# Altium schematic sheet ui_codec.SchDoc: mcHF Pro Transceiver UI board
size A3; Author: Krassi Atanassov; CompanyName: MØNKA; Engineer: For radio amateurs experimentation, non-commercial use only. Thank you!; Revision: 0.8.5; SheetTotal: 13
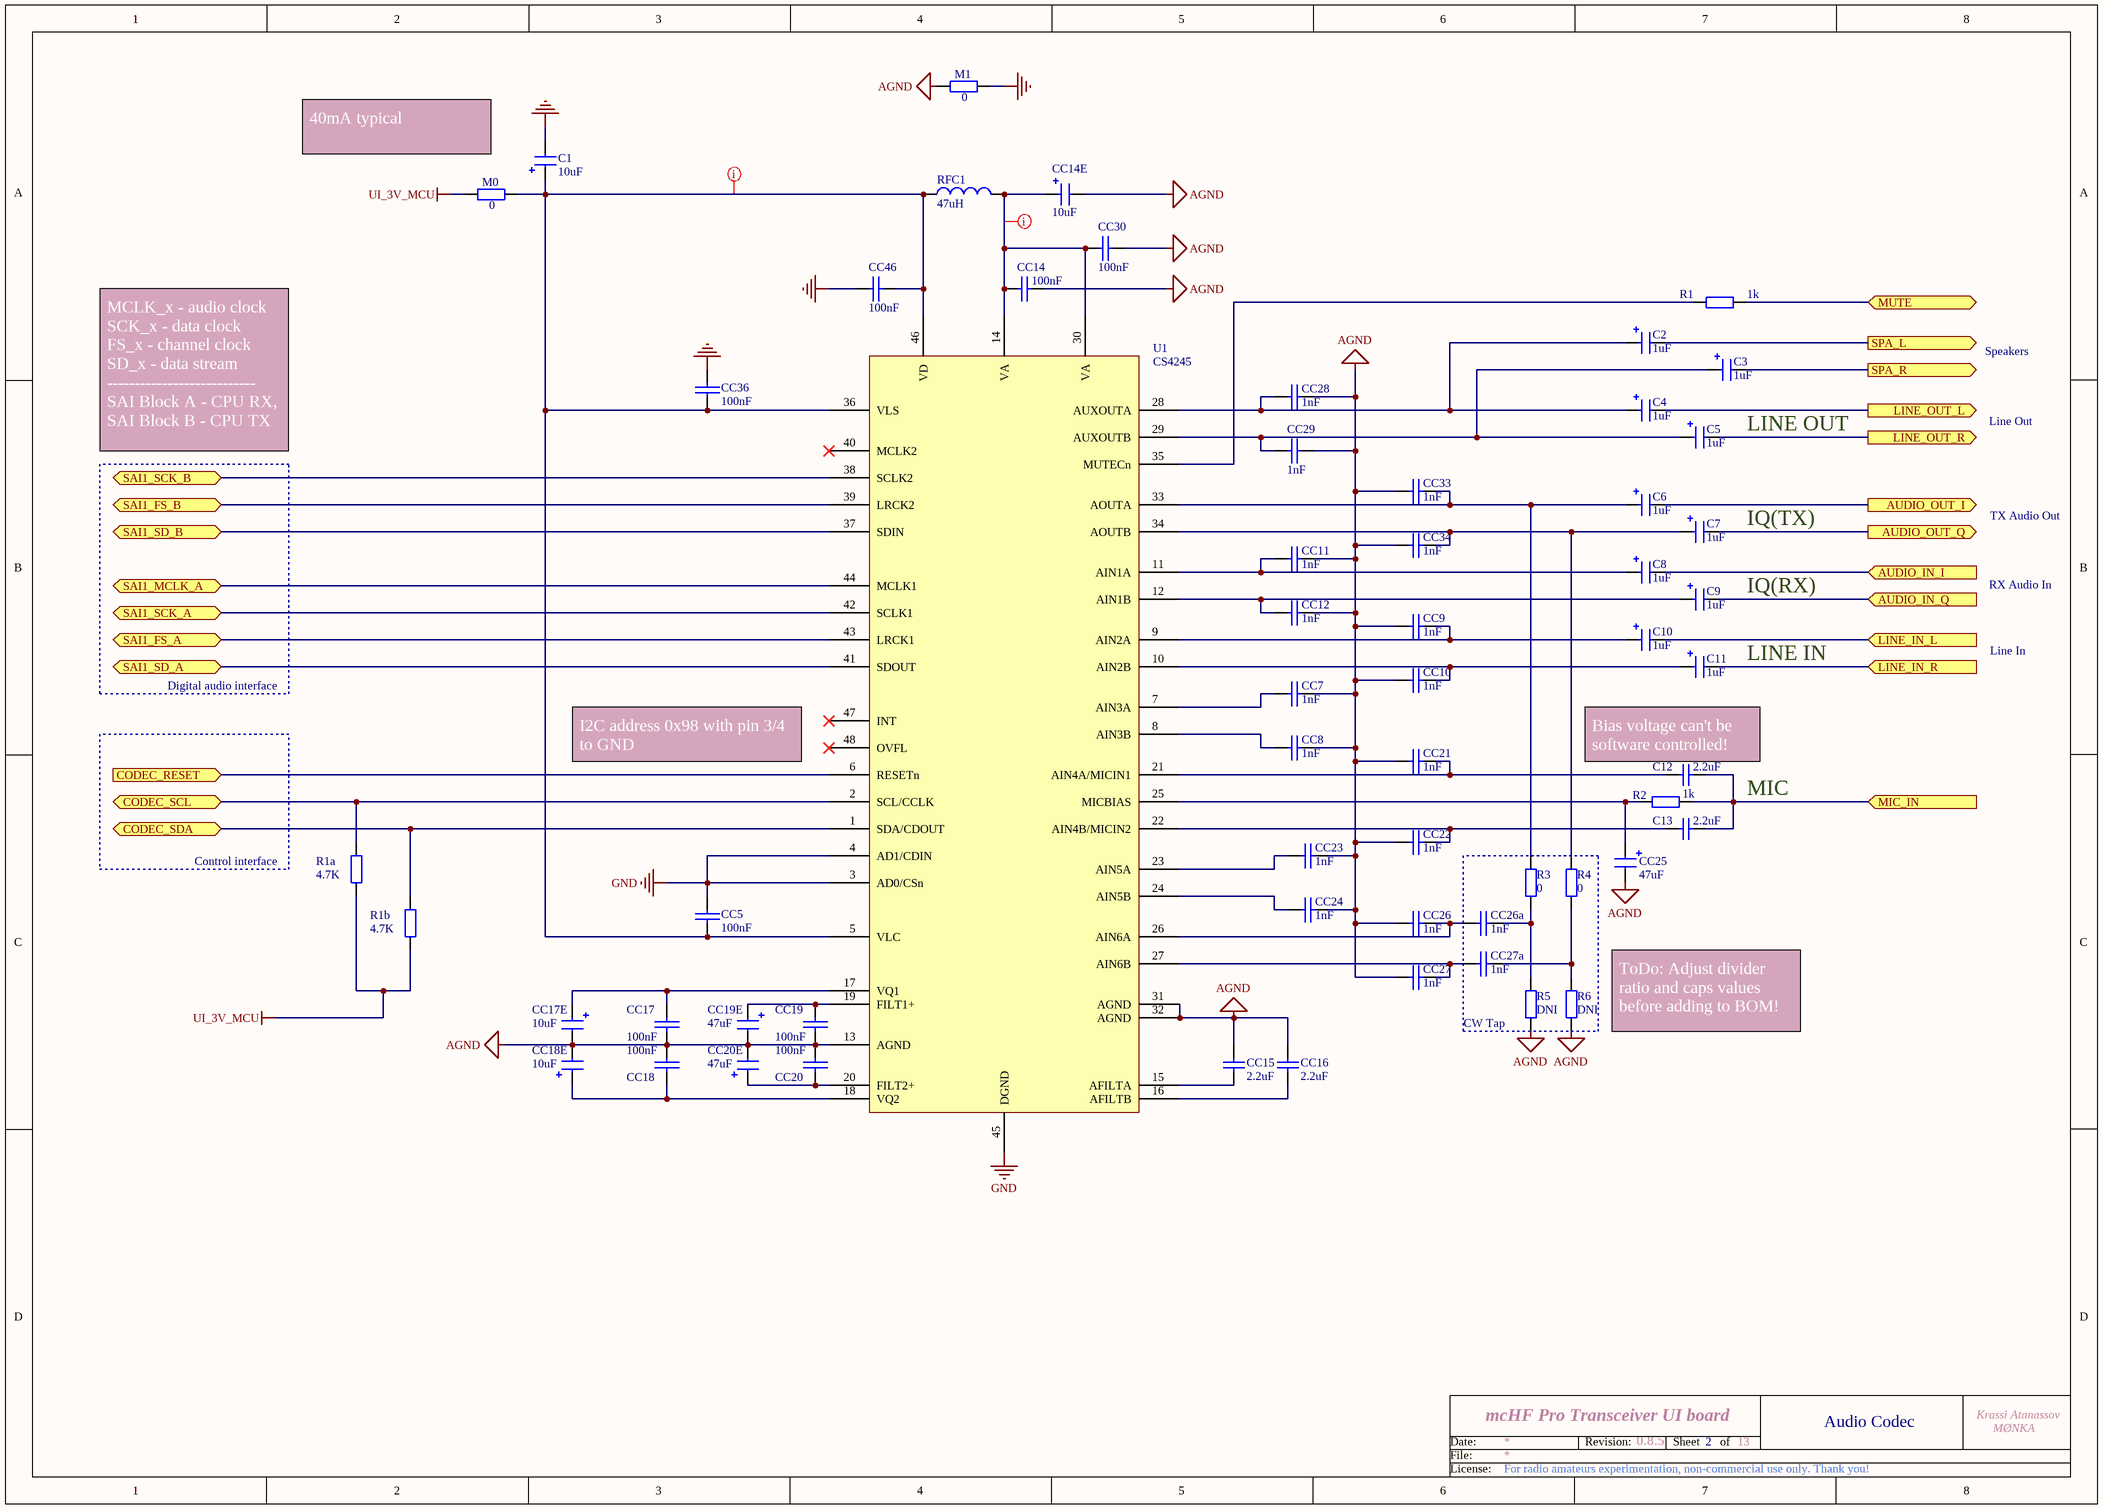
[diagram p0: ui_codec.SchDoc]

## Parts
C1  10uF  [1206_Elec_Cap]
C2  1uF  [1206_Elec_Cap]
C3  1uF  [1206_Elec_Cap]
C4  1uF  [1206_Elec_Cap]
C5  1uF  [1206_Elec_Cap]
C6  1uF  [1206_Elec_Cap]
C7  1uF  [1206_Elec_Cap]
C8  1uF  [1206_Elec_Cap]
C9  1uF  [1206_Elec_Cap]
C10  1uF  [1206_Elec_Cap]
C11  1uF  [1206_Elec_Cap]
C12  2.2uF  [0805]
C13  2.2uF  [0805]
CC5  100nF  [0805]
CC7  1nF  [0805]
CC8  1nF  [0805]
CC9  1nF  [0805]
CC10  1nF  [0805]
CC11  1nF  [0805]
CC12  1nF  [0805]
CC14  100nF  [0805]
CC14E  10uF  [1206_Elec_Cap]
CC15  2.2uF  [0805]
CC16  2.2uF  [0805]
CC17  100nF  [0805]
CC17E  10uF  [1206_Elec_Cap]
CC18  100nF  [0805]
CC18E  10uF  [1206_Elec_Cap]
CC19  100nF  [0805]
CC19E  47uF  [1206_Elec_Cap]
CC20  100nF  [0805]
CC20E  47uF  [1206_Elec_Cap]
CC21  1nF  [0805]
CC22  1nF  [0805]
CC23  1nF  [0805]
CC24  1nF  [0805]
CC25  47uF  [1206_Elec_Cap]
CC26  1nF  [0805]
CC26a  1nF  [0805]
CC27  1nF  [0805]
CC27a  1nF  [0805]
CC28  1nF  [0805]
CC29  1nF  [0805]
CC30  100nF  [0805]
CC33  1nF  [0805]
CC34  1nF  [0805]
CC36  100nF  [0805]
CC46  100nF  [0805]
M0  0  [0805]
M1  0  [0805]
R1  1k  [0805]
R1a  4.7K  [0805]
R1b  4.7K  [0805]
R2  1k  [0805]
R3  0  [0805]
R4  0  [0805]
R5  DNI  [0805]  (no BOM)
R6  DNI  [0805]  (no BOM)
RFC1  47uH  [0805]
U1  CS4245  [QUAD48]

## Blocks framed on the sheet
CW Tap: CC26a CC27a R3-R6

## Ports
AUDIO_IN_I (in), AUDIO_IN_Q (in), AUDIO_OUT_I (out), AUDIO_OUT_Q (out), CODEC_RESET (in), CODEC_SCL (bidir), CODEC_SDA (bidir), LINE_IN_L (in), LINE_IN_R (in), LINE_OUT_L (out), LINE_OUT_R (out), MIC_IN (in), MUTE (bidir), SAI1_FS_A (bidir), SAI1_FS_B (bidir), SAI1_MCLK_A (bidir), SAI1_SCK_A (bidir), SAI1_SCK_B (bidir), SAI1_SD_A (bidir), SAI1_SD_B (bidir), SPA_L (out), SPA_R (out)

## Nets
AGND: CC7.1 CC8.1 CC9.2 CC10.2 CC11.1 CC12.1 CC14.1 CC14E.2 CC15.1 CC16.1 CC17.1 CC17E.2 CC18.2 CC18E.2 CC19.1 CC19E.2 CC20.2 CC20E.2 CC21.2 CC22.2 CC23.1 CC24.1 CC25.2 CC26.2 CC27.2 CC28.1 CC29.1 CC30.1 CC33.2 CC34.2 M1.2 R5.2 R6.2 U1.13(AGND) U1.31(AGND) U1.32(AGND)
GND: C1.2 CC5.2 CC36.2 CC46.2 M1.1 U1.3(AD0/CSn) U1.4(AD1/CDIN) U1.45(DGND)
UI_3V_MCU: M0.2 R1a.2 R1b.2
AUDIO_IN_I: C8.2 ; port AUDIO_IN_I
AUDIO_IN_Q: C9.2 ; port AUDIO_IN_Q
AUDIO_OUT_I: C6.2 ; port AUDIO_OUT_I
AUDIO_OUT_Q: C7.2 ; port AUDIO_OUT_Q
CODEC_RESET: U1.6(RESETn) ; port CODEC_RESET
CODEC_SCL: R1a.1 U1.2(SCL/CCLK) ; port CODEC_SCL
CODEC_SDA: R1b.1 U1.1(SDA/CDOUT) ; port CODEC_SDA
LINE_IN_L: C10.2 ; port LINE_IN_L
LINE_IN_R: C11.2 ; port LINE_IN_R
LINE_OUT_L: C4.2 ; port LINE_OUT_L
LINE_OUT_R: C5.2 ; port LINE_OUT_R
MIC_IN: C12.2 C13.2 R2.1 ; port MIC_IN
MUTE: R1.1 ; port MUTE
SAI1_FS_A: U1.43(LRCK1) ; port SAI1_FS_A
SAI1_FS_B: U1.39(LRCK2) ; port SAI1_FS_B
SAI1_MCLK_A: U1.44(MCLK1) ; port SAI1_MCLK_A
SAI1_SCK_A: U1.42(SCLK1) ; port SAI1_SCK_A
SAI1_SCK_B: U1.38(SCLK2) ; port SAI1_SCK_B
SAI1_SD_A: U1.41(SDOUT) ; port SAI1_SD_A
SAI1_SD_B: U1.37(SDIN) ; port SAI1_SD_B
SPA_L: C2.2 ; port SPA_L
SPA_R: C3.2 ; port SPA_R
NetC1_1: C1.1 CC5.1 CC36.1 CC46.1 M0.1 RFC1.1 U1.5(VLC) U1.36(VLS) U1.46(VD)
NetC2_1: C2.1 C4.1 CC28.2 U1.28(AUXOUTA)
NetC3_1: C3.1 C5.1 CC29.2 U1.29(AUXOUTB)
NetC6_1: C6.1 CC33.1 R3.1 U1.33(AOUTA)
NetC7_1: C7.1 CC34.1 R4.1 U1.34(AOUTB)
NetC8_1: C8.1 CC11.2 U1.11(AIN1A)
NetC9_1: C9.1 CC12.2 U1.12(AIN1B)
NetC10_1: C10.1 CC9.1 U1.9(AIN2A)
NetC11_1: C11.1 CC10.1 U1.10(AIN2B)
NetC12_1: C12.1 CC21.1 U1.21(AIN4A/MICIN1)
NetC13_1: C13.1 CC22.1 U1.22(AIN4B/MICIN2)
NetCC7_2: CC7.2 U1.7(AIN3A)
NetCC8_2: CC8.2 U1.8(AIN3B)
NetCC14_2: CC14.2 CC14E.1 CC30.2 RFC1.2 U1.14(VA) U1.30(VA)
NetCC15_2: CC15.2 U1.15(AFILTA)
NetCC16_2: CC16.2 U1.16(AFILTB)
NetCC17_2: CC17.2 CC17E.1 U1.17(VQ1)
NetCC18_1: CC18.1 CC18E.1 U1.18(VQ2)
NetCC19_2: CC19.2 CC19E.1 U1.19(FILT1+)
NetCC20_1: CC20.1 CC20E.1 U1.20(FILT2+)
NetCC23_2: CC23.2 U1.23(AIN5A)
NetCC24_2: CC24.2 U1.24(AIN5B)
NetCC25_1: CC25.1 R2.2 U1.25(MICBIAS)
NetCC26_1: CC26.1 CC26a.2 U1.26(AIN6A)
NetCC26a_1: CC26a.1 R3.2 R5.1
NetCC27_1: CC27.1 CC27a.2 U1.27(AIN6B)
NetCC27a_1: CC27a.1 R4.2 R6.1
NetR1_2: R1.2 U1.35(MUTECn)

Not connected (* = marked no-connect by the designer): U1 40(MCLK2)* 47(INT)* 48(OVFL)*

## Layout directives
rule Width Constraint [Pref Width = 12mil    Min Width = 12mil    Max Width = 12mil]: NetC1_1, NetCC14_2

## Notes on the sheet
- 40mA typical
- Speakers
- MCLK_x - audio clock     SCK_x - data clock       FS_x - channel clock       SD_x - data stream         ---------------------------    SAI Block A - CPU RX, SAI Block B - CPU TX
- LINE OUT
- Line Out
- TX Audio Out
- (near C7) IQ(TX)
- RX Audio In
- IQ(RX)
- Line In
- Digital audio interface
- LINE IN
- I2C address 0x98 with pin 3/4 to GND
- (near C12) Bias voltage can't be software controlled!
- MIC
- Control interface
- (near R6) ToDo: Adjust divider ratio and caps values before adding to BOM!
- 2
- Audio Codec
- Date:
- File:
- Revision:
- Sheet
- of
- License:

## Library data of the parts
C1 CC17E CC18E = CAP-POL: Electrolitic capacitor; Order: FN 233-3009; QT Order: QCC-00166; Price: 0.204
C2 = CAP-POL: Electrolitic capacitor; Order: FN 145-7406; QT Order: QCC-00165; Notes: Tantalum capacitor; Price: 0.235
C3-C11 = CAP-POL: Electrolitic capacitor; Order: FN 145-7406; QT Order: QCC-00165; Price: 0.235
C12 C13 CC15 = CAP: Capacitor; Value: 100nF; Published: 8-Jun-2000; Revision: July-2002: Re-released for DXP Platform.; Publisher: Altium Limited
CC5 CC14 CC17-CC20 CC30 CC36 CC46 = CAP: Capacitor; Order: FN 252-2090; QT Order: QCC-00154; Price: 0.068
CC7-CC12 CC21-CC24 CC26 CC26a CC27 CC27a CC28 CC29 CC33 CC34 = CAP: Capacitor
CC14E = CAP-POL: Electrolitic capacitor; Order: FN 233-3009; QT Order: QCC-00166; Notes: Tantalum capacitor; Price: 0.204
CC16 = CAP: Capacitor; Value: 100nF; Notes: Ceramic Capacitor, low ESR; Published: 8-Jun-2000; Revision: July-2002: Re-released for DXP Platform.; Publisher: Altium Limited
CC19E CC25 = CAP-POL: Electrolitic capacitor; Notes: Tantalum Capacitor; Price: 0.204
CC20E = CAP-POL: Electrolitic capacitor; Price: 0.204
M0 M1 = RES: Resistor; Order: FN 933-3681; QT Order: QCR-00268; Price: 0.009
R1 R2 = RES: Resistor; Order: FN 933-2421; QT Order: QCR-00279; Price: 0.013
R1a R1b = RES: Resistor; Order: FN 200-8383; QT Order: QCR-00341; Price: 0.024
R3-R6 = RES: Resistor; Price: 0.013
RFC1 = Inductor: Order: FN 166-9895; Price: 0.16
U1 = CS4245: Audio CODEC